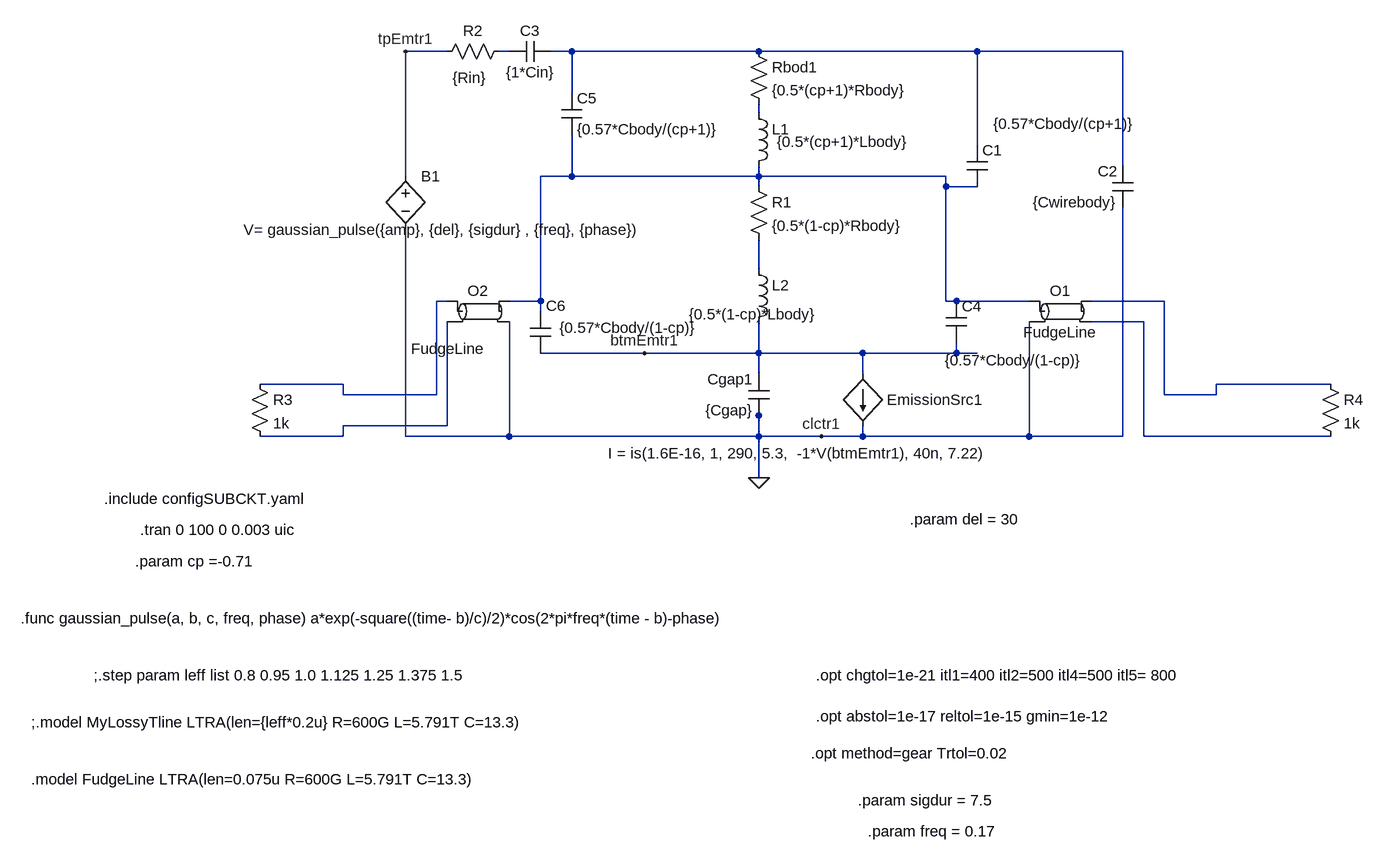
[diagram p0: schematic update_antenna_modle_Copy2.asc]
update_antenna_modle_Copy2.asc, the LTspice schematic file:
Version 4.1
SHEET 1 1176 832
WIRE -240 -384 -304 -384
WIRE -144 -384 -160 -384
WIRE -48 -384 -80 -384
WIRE 240 -384 -48 -384
WIRE 576 -384 240 -384
WIRE 800 -384 576 -384
WIRE -48 -320 -48 -384
WIRE 240 -288 240 -304
WIRE 576 -240 576 -384
WIRE 800 -208 800 -384
WIRE -304 -192 -304 -384
WIRE -48 -192 -48 -256
WIRE -48 -192 -96 -192
WIRE 240 -192 240 -208
WIRE 240 -192 -48 -192
WIRE 528 -192 240 -192
WIRE 240 -176 240 -192
WIRE 528 -176 528 -192
WIRE 576 -176 528 -176
WIRE 240 -48 240 -96
WIRE -240 0 -256 0
WIRE -96 0 -96 -192
WIRE -96 0 -144 0
WIRE 528 0 528 -176
WIRE 544 0 528 0
WIRE 656 0 544 0
WIRE 864 0 752 0
WIRE -96 16 -96 0
WIRE 832 32 752 32
WIRE 64 80 -96 80
WIRE 240 80 240 32
WIRE 240 80 64 80
WIRE 400 80 240 80
WIRE 544 80 544 64
WIRE 544 80 400 80
WIRE 576 80 544 80
WIRE 240 112 240 80
WIRE 400 112 400 80
WIRE -400 128 -528 128
WIRE 1120 128 944 128
WIRE -400 144 -400 128
WIRE -256 144 -256 0
WIRE -256 144 -400 144
WIRE 864 144 864 0
WIRE 944 144 944 128
WIRE 944 144 864 144
WIRE 240 176 240 160
WIRE -240 192 -240 32
WIRE -240 192 -400 192
WIRE -400 208 -400 192
WIRE -400 208 -528 208
WIRE -304 208 -304 -112
WIRE -144 208 -144 32
WIRE -144 208 -304 208
WIRE 240 208 240 176
WIRE 240 208 -144 208
WIRE 336 208 240 208
WIRE 400 208 400 192
WIRE 400 208 336 208
WIRE 656 208 656 32
WIRE 656 208 400 208
WIRE 800 208 800 -144
WIRE 800 208 656 208
WIRE 832 208 832 32
WIRE 1120 208 832 208
WIRE 240 272 240 208
FLAG 64 80 btmEmtr1
FLAG 336 208 clctr1
FLAG -304 -384 tpEmtr1
FLAG 240 272 0
SYMBOL cap 560 -240 R0
WINDOW 3 41 -33 Left 2
SYMATTR Value {0.57*Cbody/(cp+1)}
SYMATTR InstName C1
SYMBOL cap 256 176 R180
WINDOW 0 24 56 Left 2
WINDOW 3 24 8 Left 2
SYMATTR InstName Cgap1
SYMATTR Value {Cgap}
SYMBOL cap 816 -144 R180
WINDOW 0 24 56 Left 2
WINDOW 3 24 8 Left 2
SYMATTR InstName C2
SYMATTR Value {Cwirebody}
SYMBOL res 224 -400 R0
SYMATTR InstName Rbod1
SYMATTR Value {0.5*(cp+1)*Rbody}
SYMBOL res 224 -192 R0
SYMATTR InstName R1
SYMATTR Value {0.5*(1-cp)*Rbody}
SYMBOL ind 224 -304 R0
WINDOW 3 44 59 Left 2
SYMATTR Value {0.5*(cp+1)*Lbody}
SYMATTR InstName L1
SYMBOL ind 224 -64 R0
WINDOW 3 -92 84 Left 2
SYMATTR Value {0.5*(1-cp)*Lbody}
SYMATTR InstName L2
SYMBOL res -144 -400 R90
WINDOW 0 0 56 VBottom 2
WINDOW 3 41 61 VTop 2
SYMATTR InstName R2
SYMATTR Value {Rin}
SYMBOL cap -80 -400 R90
WINDOW 0 0 32 VBottom 2
WINDOW 3 32 32 VTop 2
SYMATTR InstName C3
SYMATTR Value {1*Cin}
SYMBOL cap 528 0 R0
WINDOW 3 -2 91 Left 2
SYMATTR Value {0.57*Cbody/(1-cp)}
SYMATTR InstName C4
SYMBOL cap -64 -320 R0
SYMATTR InstName C5
SYMATTR Value {0.57*Cbody/(cp+1)}
SYMBOL cap -112 16 R0
WINDOW 0 24 -9 Left 2
WINDOW 3 45 25 Left 2
SYMATTR InstName C6
SYMATTR Value {0.57*Cbody/(1-cp)}
SYMBOL ltline 704 16 R0
SYMATTR InstName O1
SYMATTR Value FudgeLine
SYMBOL ltline -192 16 R0
WINDOW 3 -46 42 Top 2
SYMATTR Value FudgeLine
SYMATTR InstName O2
SYMBOL bv -304 -208 R0
WINDOW 3 -249 98 Left 2
SYMATTR Value V= gaussian_pulse({amp}, {del}, {sigdur} , {freq}, {phase})
SYMATTR InstName B1
SYMBOL bi 400 112 R0
WINDOW 3 -392 122 Left 2
WINDOW 0 37 40 Left 2
SYMATTR Value I = is(1.6E-16, 1, 290, 5.3,  -1*V(btmEmtr1), 40n, 7.22)
SYMATTR InstName EmissionSrc1
SYMBOL res -544 112 R0
SYMATTR InstName R3
SYMATTR Value 1k
SYMBOL res 1104 112 R0
SYMATTR InstName R4
SYMATTR Value 1k
TEXT -768 304 Left 2 !.include configSUBCKT.yaml
TEXT -712 352 Left 2 !.tran 0 100 0 0.003 uic
TEXT -720 400 Left 2 !.param cp =-0.71
TEXT -784 576 Left 2 !;.step param leff list 0.8 0.95 1.0 1.125 1.25 1.375 1.5
TEXT -896 488 Left 2 !.func gaussian_pulse(a, b, c, freq, phase) a*exp(-square((time- b)/c)/2)*cos(2*pi*freq*(time - b)-phase)
TEXT 472 336 Left 2 !.param del = 30
TEXT 320 696 Left 2 !.opt method=gear Trtol=0.02
TEXT 392 768 Left 2 !.param sigdur = 7.5
TEXT 408 816 Left 2 !.param freq = 0.17
TEXT -880 648 Left 2 !;.model MyLossyTline LTRA(len={leff*0.2u} R=600G L=5.791T C=13.3)
TEXT -880 736 Left 2 !.model FudgeLine LTRA(len=0.075u R=600G L=5.791T C=13.3)
TEXT 328 576 Left 2 !.opt chgtol=1e-21 itl1=400 itl2=500 itl4=500 itl5= 800\n \n.opt abstol=1e-17 reltol=1e-15 gmin=1e-12

The netlist it stands for:
* update_antenna_modle_Copy2.asc
C1 N002 N004 {0.57*Cbody/(cp+1)}
Cgap1 0 btmEmtr1 {Cgap}
C2 0 N002 {Cwirebody}
Rbod1 N002 N003 {0.5*(cp+1)*Rbody}
R1 N004 N005 {0.5*(1-cp)*Rbody}
L1 N003 N004 {0.5*(cp+1)*Lbody}
L2 N005 btmEmtr1 {0.5*(1-cp)*Lbody}
R2 N001 tpEmtr1 {Rin}
C3 N002 N001 {1*Cin}
C4 N004 btmEmtr1 {0.57*Cbody/(1-cp)}
C5 N002 N004 {0.57*Cbody/(cp+1)}
C6 N004 btmEmtr1 {0.57*Cbody/(1-cp)}
O1 N004 0 N007 N008 FudgeLine
O2 N006 N009 N004 0 FudgeLine
B1 tpEmtr1 0 V= gaussian_pulse({amp}, {del}, {sigdur} , {freq}, {phase})
B§EmissionSrc1 btmEmtr1 0 I = is(1.6E-16, 1, 290, 5.3,  -1*V(btmEmtr1), 40n, 7.22)
R3 N006 N009 1k
R4 N007 N008 1k
.include configSUBCKT.yaml
.tran 0 100 0 0.003 uic
.param cp =-0.71
;.step param leff list 0.8 0.95 1.0 1.125 1.25 1.375 1.5
.func gaussian_pulse(a, b, c, freq, phase) a*exp(-square((time- b)/c)/2)*cos(2*pi*freq*(time - b)-phase)
.param del = 30
.opt method=gear Trtol=0.02
.param sigdur = 7.5
.param freq = 0.17
;.model MyLossyTline LTRA(len={leff*0.2u} R=600G L=5.791T C=13.3)
.model FudgeLine LTRA(len=0.075u R=600G L=5.791T C=13.3)
.opt chgtol=1e-21 itl1=400 itl2=500 itl4=500 itl5= 800
.opt abstol=1e-17 reltol=1e-15 gmin=1e-12
.backanno
.end